# EAGLE design MaTouch ESP32-S3 AMOLED AI CAMERA v1.1 (EAGLE 6.1)
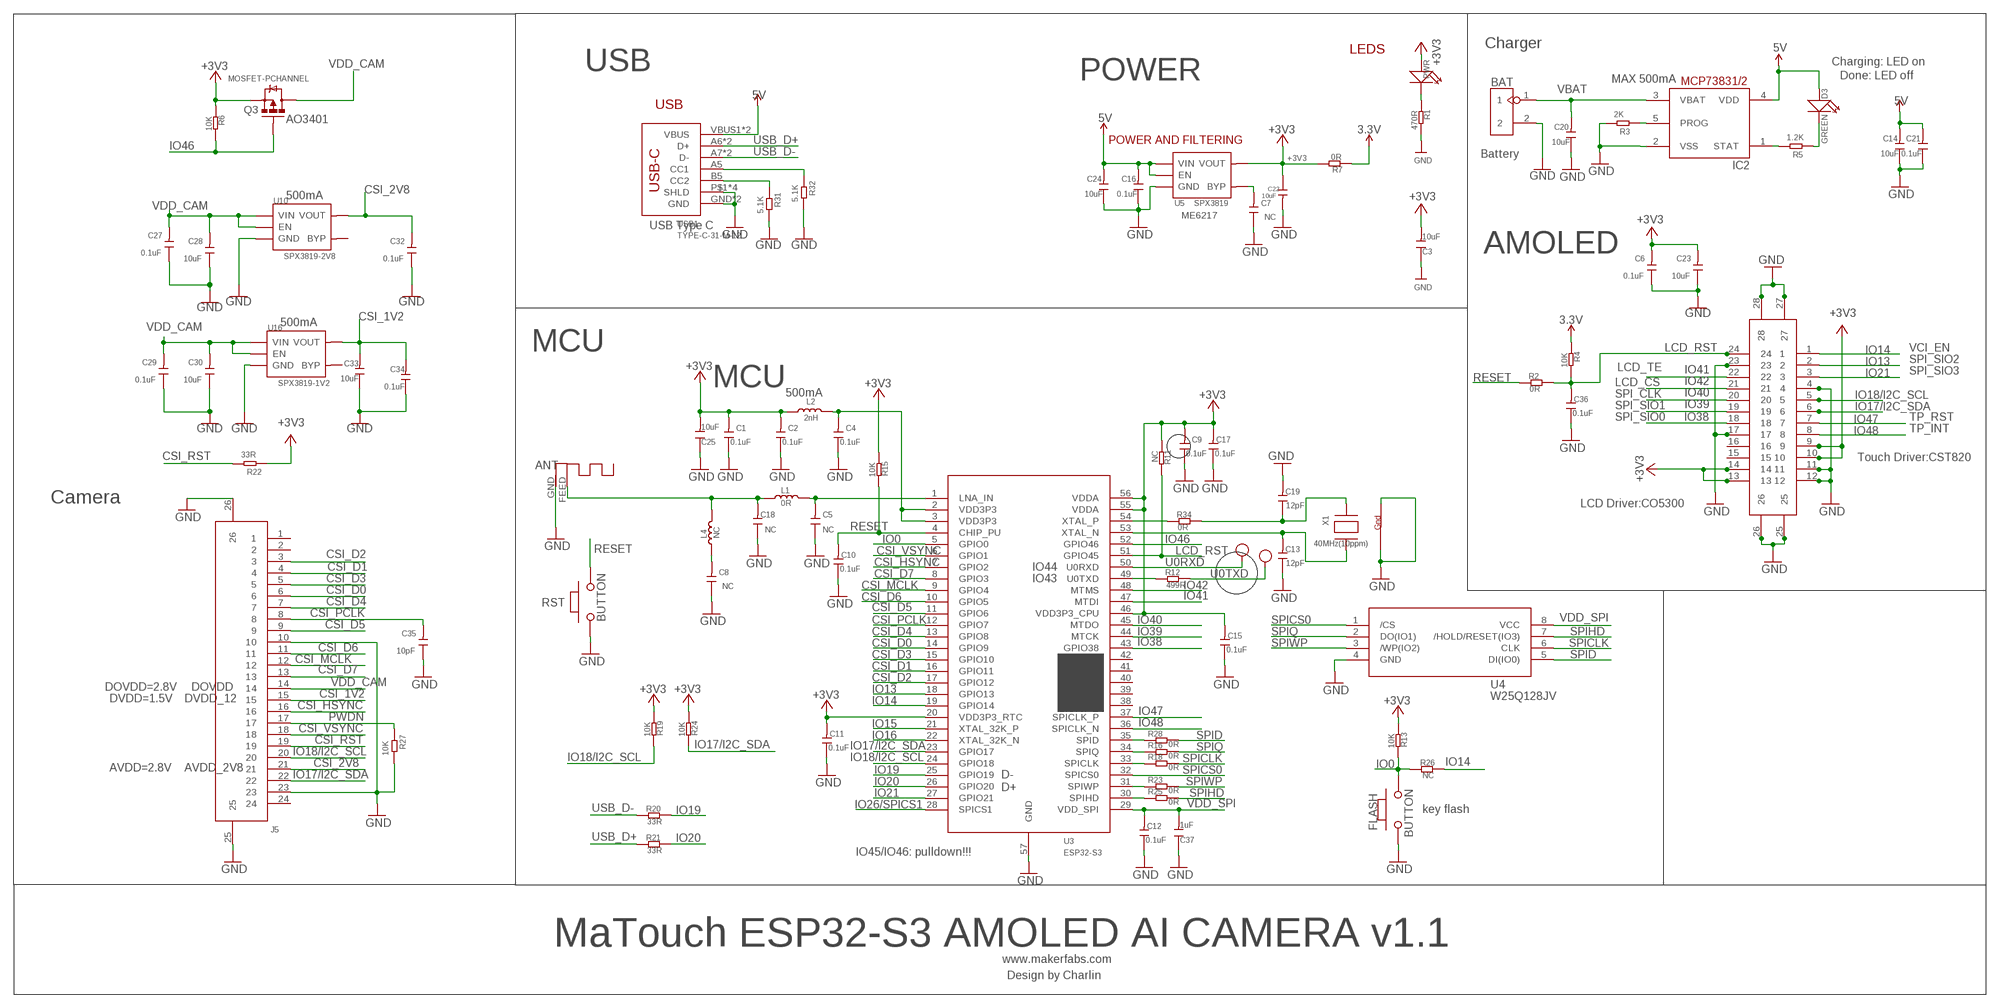
[diagram p0: schematic, sheet 1]

## Parts
ANT1  ANTENNA  [RN-ANT]
BAT  HEADER-2P-2.0  [2P-2.0]
C1  0.1uF  DISCRETE_C-0402  [DISCRETE_C0402]
C2  0.1uF  DISCRETE_C-0402  [DISCRETE_C0402]
C3  10uF  DISCRETE_C-0603  [DISCRETE_C0603]
C4  0.1uF  DISCRETE_C-0402  [DISCRETE_C0402]
C5  NC  DISCRETE_C-0402  [DISCRETE_C0402]
C6  0.1uF  DISCRETE_C-0402  [DISCRETE_C0402]
C7  NC  DISCRETE_C-0402  [DISCRETE_C0402]
C8  NC  DISCRETE_C-0402  [DISCRETE_C0402]
C9  0.1uF  DISCRETE_C-0402  [DISCRETE_C0402]
C10  0.1uF  DISCRETE_C-0402  [DISCRETE_C0402]
C11  0.1uF  DISCRETE_C-0402  [DISCRETE_C0402]
C12  0.1uF  DISCRETE_C-0402  [DISCRETE_C0402]
C13  12pF  DISCRETE_C-0402  [DISCRETE_C0402]
C14  10uF  DISCRETE_C-0402  [DISCRETE_C0402]
C15  0.1uF  DISCRETE_C-0402  [DISCRETE_C0402]
C16  0.1uF  DISCRETE_C-0402  [DISCRETE_C0402]
C17  0.1uF  DISCRETE_C-0402  [DISCRETE_C0402]
C18  NC  DISCRETE_C-0402  [DISCRETE_C0402]
C19  12pF  DISCRETE_C-0402  [DISCRETE_C0402]
C20  10uF  DISCRETE_C-0402  [DISCRETE_C0402]
C21  0.1uF  DISCRETE_C-0402  [DISCRETE_C0402]
C22  10uF  C-0603  [0603]
C23  10uF  DISCRETE_C-0402  [DISCRETE_C0402]
C24  10uF  DISCRETE_C-0402  [DISCRETE_C0402]
C25  10uF  DISCRETE_C-0603  [DISCRETE_C0603]
C27  0.1uF  DISCRETE_C-0402  [DISCRETE_C0402]
C28  10uF  DISCRETE_C-0402  [DISCRETE_C0402]
C29  0.1uF  DISCRETE_C-0402  [DISCRETE_C0402]
C30  10uF  DISCRETE_C-0402  [DISCRETE_C0402]
C32  0.1uF  DISCRETE_C-0402  [DISCRETE_C0402]
C33  10uF  DISCRETE_C-0402  [DISCRETE_C0402]
C34  0.1uF  DISCRETE_C-0402  [DISCRETE_C0402]
C35  10pF  DISCRETE_C-0402  [DISCRETE_C0402]
C36  0.1uF  DISCRETE_C-0402  [DISCRETE_C0402]
C37  1uF  DISCRETE_C-0603  [DISCRETE_C0603]
D3  GREEN  DISCRETE_LED0603  [DISCRETE_LED-0603]
FLASH  BUTTON  PB157  [157SW]
IC2  TP4054  MCP73831/OT  [SOT23-5L]
J1  OK-14GF024-04/AXE524127  AXE524127  [SMD24-50P-730L250W77H]
J5  FPC-24P  [SMD26-50P-1760L450W]
L1  0R  DISCRETE_L0402  [DISCRETE_L0402]
L2  2nH  DISCRETE_L0603  [DISCRETE_L0603]
L4  NC  DISCRETE_L0402  [DISCRETE_L0402]
PWR  DISCRETE_LED0603  [DISCRETE_LED-0603]
Q3  MOSFET-PCHANNEL  [SOT23-3]
R1  470R  DISCRETE_R-0402  [DISCRETE_R0402]
R2  0R  DISCRETE_R-0402  [DISCRETE_R0402]
R3  2K  DISCRETE_R-0402  [DISCRETE_R0402]
R4  10K  DISCRETE_R-0402  [DISCRETE_R0402]
R5  1.2K  DISCRETE_R-0402  [DISCRETE_R0402]
R6  10K  DISCRETE_R-0402  [DISCRETE_R0402]
R7  0R  DISCRETE_R-0402  [DISCRETE_R0402]
R11  NC  DISCRETE_R-0402  [DISCRETE_R0402]
R12  499R  DISCRETE_R-0402  [DISCRETE_R0402]
R13  10K  DISCRETE_R-0402  [DISCRETE_R0402]
R15  10K  DISCRETE_R-0402  [DISCRETE_R0402]
R16  0R  DISCRETE_R-0402  [DISCRETE_R0402]
R18  0R  DISCRETE_R-0402  [DISCRETE_R0402]
R19  10K  DISCRETE_R-0402  [DISCRETE_R0402]
R20  33R  DISCRETE_R-0402  [DISCRETE_R0402]
R21  33R  DISCRETE_R-0402  [DISCRETE_R0402]
R22  33R  DISCRETE_R-0402  [DISCRETE_R0402]
R23  0R  DISCRETE_R-0402  [DISCRETE_R0402]
R24  10K  DISCRETE_R-0402  [DISCRETE_R0402]
R25  0R  DISCRETE_R-0402  [DISCRETE_R0402]
R26  NC  DISCRETE_R-0402  [DISCRETE_R0402]
R27  10K  DISCRETE_R-0402  [DISCRETE_R0402]
R28  0R  DISCRETE_R-0402  [DISCRETE_R0402]
R31  5.1K  DISCRETE_R-0402  [DISCRETE_R0402]
R32  5.1K  DISCRETE_R-0402  [DISCRETE_R0402]
R34  0R  DISCRETE_R-0402  [DISCRETE_R0402]
RST  BUTTON  PB157  [157SW]
RX  TEST-POINT'4545'  [TP-D45MIL]
TX  TEST-POINT'4545'  [TP-D45MIL]
U3  ESP32-S3  [QFN56-7*7MM]
U4  W25Q128JV  [SOIC-8-208MIL]
U5  SPX3819  [SOT23-5]
U10  SPX3819-2V8  SPX3819  [SOT23-5]
U16  SPX3819-1V2  SPX3819  [SOT23-5]
USB1  TYPE-C-31-M-12  [TYPE-C-31-M-12]
X1  40MHz(10ppm)  XTAL-4-3225  [NX3225]

## Nets
3.3V: R4.2 R7.2
5V: C14.2 C16.2 C21.2 C24.2 D3.+ IC2.4(VDD) U5.1(VIN) U5.3(EN) USB1.VBUS1(VBUS) USB1.VBUS2(VBUS)
+3V3: C1.2 C2.2 C3.2 C6.2 C9.2 C11.2 C15.2 C17.2 C22.1 C23.2 C25.2 J1.9 J1.10 J1.13 J1.14 L2.1 PWR.+ Q3.2(S) R6.2 R7.1 R11.2 R13.2 R15.2 R19.2 R22.1 R24.2 U3.20(VDD3P3_RTC) U3.46(VDD3P3_CPU) U3.55(VDDA) U3.56(VDDA) U5.5(VOUT)
CSI_1V2: C33.2 C34.2 J5.15 U16.5(VOUT)
CSI_2V8: C32.2 J5.21 U10.5(VOUT)
CSI_D0: J5.6 U3.14(GPIO9)
CSI_D1: J5.4 U3.16(GPIO11)
CSI_D2: J5.3 U3.17(GPIO12)
CSI_D3: J5.5 U3.15(GPIO10)
CSI_D4: J5.7 U3.13(GPIO8)
CSI_D5: J5.9 U3.11(GPIO6)
CSI_D6: J5.11 U3.10(GPIO5)
CSI_D7: J5.13 U3.8(GPIO3)
CSI_HSYNC: J5.16 U3.7(GPIO2)
CSI_MCLK: J5.12 U3.9(GPIO4)
CSI_PCLK: C35.2 J5.8 U3.12(GPIO7)
CSI_RST: J5.19 R22.2
CSI_VSYNC: J5.18 U3.6(GPIO1)
GND: ANT1.GND BAT.2 C1.1 C2.1 C3.1 C4.1 C5.1 C6.1 C7.1 C8.1 C9.1 C10.1 C11.1 C12.1 C13.1 C14.1 C15.1 C16.1 C17.1 C18.1 C19.2 C20.1 C21.1 C22.2 C23.1 C24.1 C25.1 C27.1 C28.1 C29.1 C30.1 C32.1 C33.1 C34.1 C35.1 C36.1 C37.1 FLASH.1 IC2.2(VSS) J1.4 J1.11 J1.12 J1.17 J1.23 J1.25 J1.26 J1.27 J1.28 J5.10 J5.23 J5.25 J5.26 R1.1 R3.2 R27.2 R31.2 R32.2 RST.1 U3.57(GND) U4.4(GND) U5.2(GND) U10.2(GND) U16.2(GND) USB1.GND USB1.GND2(GND) USB1.P$1(SHLD) USB1.P$2(SHLD) USB1.P$3(SHLD) USB1.P$4(SHLD) X1.2(G2) X1.4(G1)
IO0: FLASH.2 R13.1 R26.2 U3.5(GPIO0)
IO13: J1.2 U3.18(GPIO13)
IO14: J1.1 R26.1 U3.19(GPIO14)
IO15: U3.21(XTAL_32K_P)
IO16: U3.22(XTAL_32K_N)
IO17/I2C_SDA: J1.6 J5.22 R24.1 U3.23(GPIO17)
IO18/I2C_SCL: J1.5 J5.20 R19.1 U3.24(GPIO18)
IO19: R20.1 U3.25(GPIO19)
IO20: R21.1 U3.26(GPIO20)
IO21: J1.3 U3.27(GPIO21)
IO26/SPICS1: U3.28(SPICS1)
IO38: J1.18 U3.43(GPIO38)
IO39: J1.19 U3.44(MTCK)
IO40: J1.20 U3.45(MTDO)
IO41: J1.22 U3.47(MTDI)
IO42: J1.21 U3.48(MTMS)
IO46: Q3.1(G) R6.1 U3.52(GPIO46)
IO47: J1.7 U3.37(SPICLK_P)
IO48: J1.8 U3.36(SPICLK_N)
LCD_RST: C36.2 J1.24 R2.1 R4.1 R11.1 U3.51(GPIO45)
N$1: ANT1.FEED C18.2 L1.1 L4.2
N$2: C5.2 L1.2 U3.1(LNA_IN)
N$3: R28.2 U3.35(SPID)
N$4: C8.2 L4.1
N$5: R32.1 USB1.A5(CC1)
N$7: PWR.- R1.2
N$23: IC2.5(PROG) R3.1
N$30: IC2.1(STAT) R5.2
N$32: D3.- R5.1
N$33: C4.2 L2.2 U3.2(VDD3P3) U3.3(VDD3P3)
N$34: R31.1 USB1.B5(CC2)
N$35: R16.2 U3.34(SPIQ)
N$37: R34.2 U3.54(XTAL_P)
N$38: R18.2 U3.33(SPICLK)
N$40: R23.2 U3.31(SPIWP)
N$41: R25.2 U3.30(SPIHD)
N$63: R12.2 U3.49(U0TXD)
N$65: C13.2 U3.53(XTAL_N) X1.3(X2)
N$66: C19.1 R34.1 X1.1(X1)
N$76: C7.2 U5.4(BYP)
PWDN: J5.17 R27.1
RESET: C10.2 R2.2 R15.1 RST.2 U3.4(CHIP_PU)
SPICLK: R18.1 U4.6(CLK)
SPICS0: U3.32(SPICS0) U4.1(/CS)
SPID: R28.1 U4.5(DI(IO0))
SPIHD: R25.1 U4.7(/HOLD/RESET(IO3))
SPIQ: R16.1 U4.2(DO(IO1))
SPIWP: R23.1 U4.3(/WP(IO2))
U0RXD: RX.T U3.50(U0RXD)
U0TXD: R12.1 TX.T
USB_D+: R21.2 USB1.A6(D+) USB1.B6(D+)
USB_D-: R20.2 USB1.A7(D-) USB1.B7(D-)
VBAT: BAT.1 C20.2 IC2.3(VBAT)
VDD_CAM: C27.2 C28.2 C29.2 C30.2 J5.14 Q3.3(D) U10.1(VIN) U10.3(EN) U16.1(VIN) U16.3(EN)
VDD_SPI: C12.2 C37.2 U3.29(VDD_SPI) U4.8(VCC)
Unconnected: J1.15 J1.16 J5.1 J5.2 J5.24 U3.38(GPIO33) U3.39(GPIO34) U3.40(GPIO35) U3.41(GPIO36) U3.42(GPIO37) U10.4(BYP) U16.4(BYP)

## Notes on the sheet
- Charger
- LEDS
- Charging: LED on
- USB
- POWER | Done: LED off
- MAX 500mA
- USB
- AO3401
- POWER AND FILTERING
- Battery
- 500mA
- ME6217
- USB Type C
- AMOLED
- 500mA
- MCU | VCI_EN
- SPI_SIO2
- LCD_TE
- SPI_SIO3
- MCU | LCD_CS
- 500mA | SPI_CLK
- SPI_SIO1
- SPI_SIO0 | TP_RST
- TP_INT
- Touch Driver:CST820
- ANT
- Camera
- LCD Driver:CO5300
- IO44
- IO43
- DOVDD=2.8V | DOVDD
- DVDD=1.5V | DVDD_12
- AVDD=2.8V | AVDD_2V8
- D-
- D+
- key flash
- IO45/IO46: pulldown!!!
- MaTouch ESP32-S3 AMOLED AI CAMERA v1.1
- www.makerfabs.com
- Design by Charlin

## Library data of the parts
ANT1 = adafruit:ANTENNA
BAT = Connector:HEADER-2P
C1-C21 C23-C25 C27-C30 C32-C37 = A9G:DISCRETE_C*: Ceramic Capacitors
C22 = Discrete:C*: Ceramic Capacitors
D3 PWR = A9G:DISCRETE_LED*
FLASH RST = MySMD:PB157
IC2 = adafruit:MCP73831: MCP73831/2 Miniature Single-Cell, Fully Integrated Li-Ion, Li-Polymer Charge Management Controllers. Nice and small simple lipoly charge controller, with adjustable current and status output (LED) http://www.ladyada.net/library/pcb/eaglelibrary.html
J1 = user:AXE524127
J5 = self:FPC-24P
L1 L2 L4 = A9G:DISCRETE_L*
Q3 = User-Submitted:MOSFET-PCHANNEL: Generic PMOSFET IRLML2244 - TRANS-11153 (SOT-23 -20V -4.3A) (1.Gate 2.Source 3.Drain) FQP27P06 - COM-10349 <http://www.sparkfun.com/products/10349> (TO-220 -60V -27A) (1.Gate 2.Source 3.Drain); PROD_ID: TRANS-08285
R1-R7 R11-R13 R15 R16 R18-R28 R31 R32 R34 = A9G:DISCRETE_R*
RX TX = Discrete-new:TEST-POINT; PARTNO: DNP
U3 = sale:ESP32-S3
U4 = self:W25Q128JV
U5 U10 U16 = IC:SPX3819
USB1 = sale:TYPE-C-31-M-12
X1 = adafruit:XTAL-4: Classic 4-pin 3.2 x 2.5mm crystal

## Net classes
0 default: width 0.203 mm
1 vbat: width 0.254 mm, drill 0.305 mm, clearance 0.203 mm

## Board
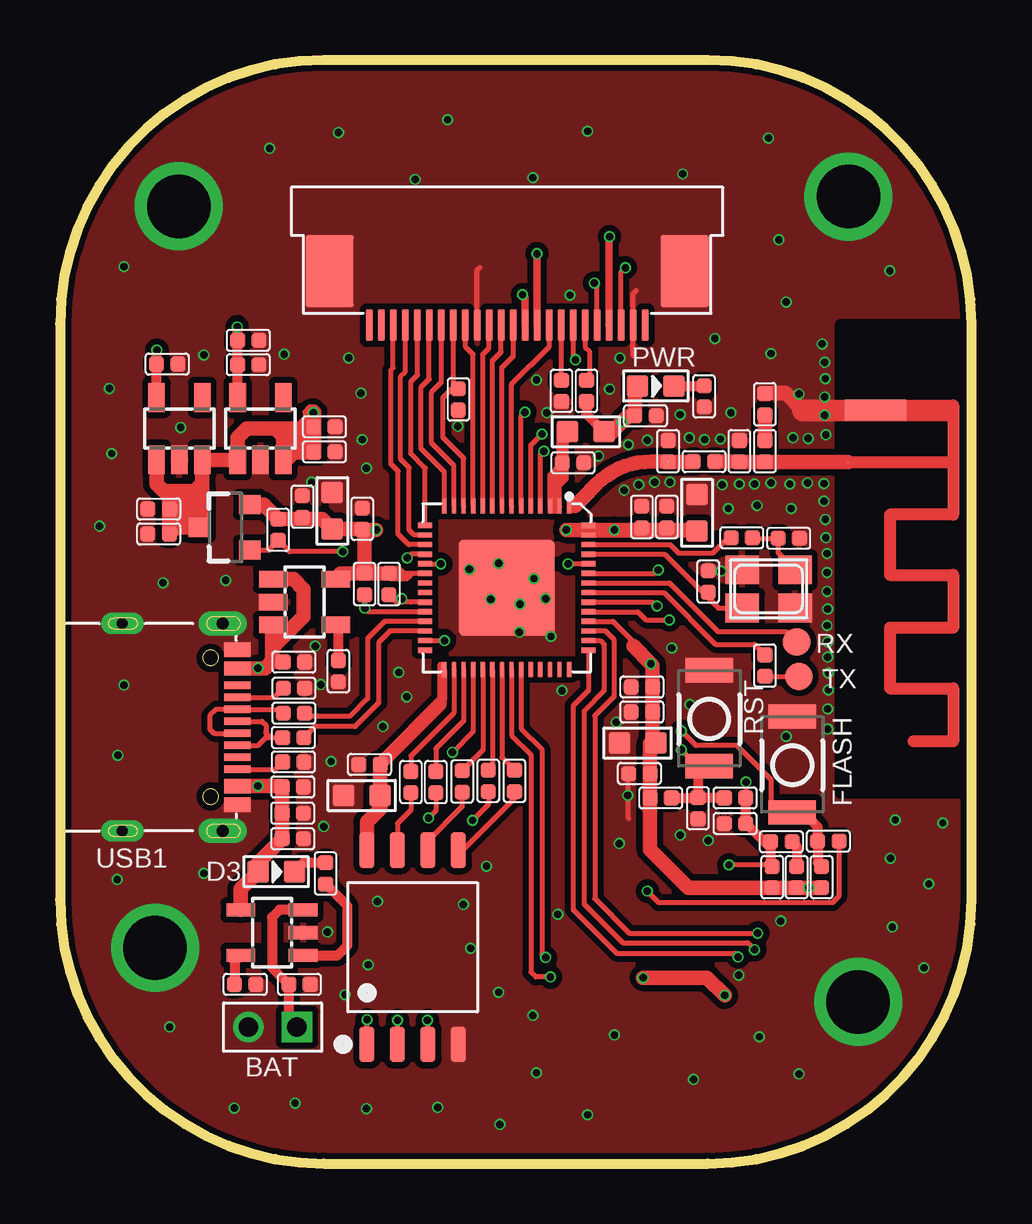
[diagram p1: board, top side]
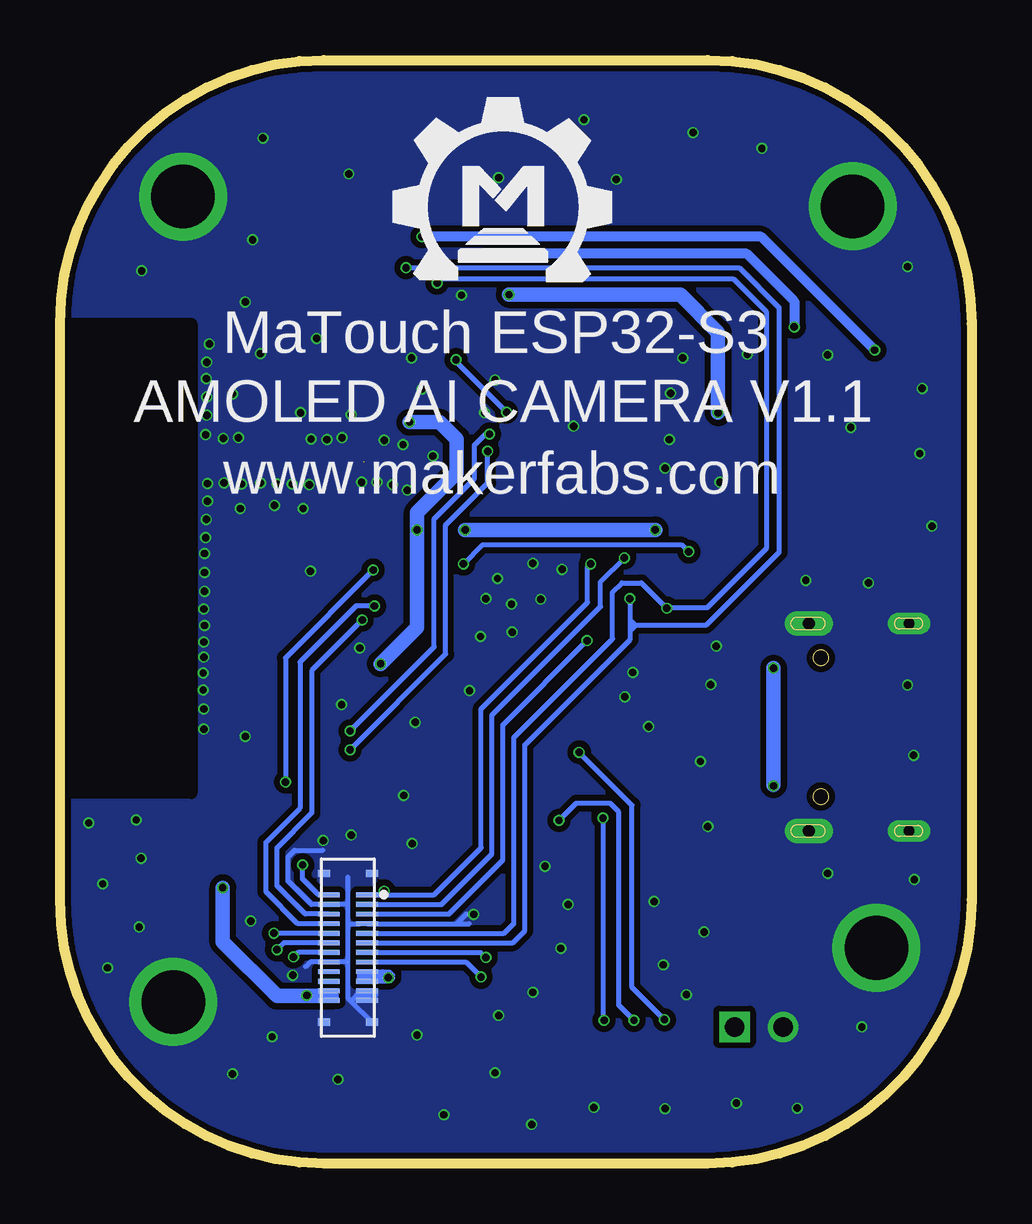
[diagram p2: board, bottom side, seen from below]

Size 38 x 46 mm. Coordinates in mm from the lower left corner, seen from the top.
Outline: 38,11 38,35 arc90 27,46 11,46 arc90 0,35 0,11 arc90 11,0 27,0 arc90 38,11
Copper layers (1*16): Top 0.035mm / dielectric 1.5mm / Bottom 0.035mm
Design rules: minimum track width 6mil, minimum drill 10mil, track to track 6mil, track to pad 6mil, pad to pad 6mil, via to via 6mil, smd to smd 0mil, copper to edge 10mil, drill to drill 10mil, minimum pad ring 3mil, minimum via ring 3mil, stop-mask expansion 2mil, vias tented up to drill 100mil, thermal gap 0mil
tRestrict: area 32.5,15.5 to 40.1,35
bRestrict: area 32.5,15.4 to 40.1,35

### Footprints (pad centres in the part's own frame; a part is rotated, then mirrored left to right if it is on the bottom)
RN-ANT = smd 0.025 x 0.025: FEED 0,2.159 | smd 2.54 x 0.889: GND -1.143,0
2P-2.0 = drill 0.813 pad 1.27 square: 1 -1.016,0 | drill 0.813 pad 1.27: 2 1.016,0
DISCRETE_C0402 = smd 0.635 x 0.635: 1 -0.445,0; 2 0.445,0
DISCRETE_C0603 = smd 0.889 x 0.889: 1 -0.762,0; 2 0.762,0
0603 = smd 0.889 x 0.889: 1 -0.762,0; 2 0.762,0
DISCRETE_LED-0603 = smd 0.889 x 0.889: + -0.762,0; - 0.762,0
157SW = smd 1.016 x 1.981: 1 0,0; 2 4,0
SOT23-5L = smd 0.55 x 1.2: 1 -0.95,-1.3; 2 0,-1.3; 3 0.95,-1.3; 4 0.95,1.3; 5 -0.95,1.3
SMD24-50P-730L250W77H = smd 0.2 x 0.9: 1 -2.2,0.8; 2 -1.8,0.8; 3 -1.4,0.8; 4 -1,0.8; 5 -0.6,0.8; 6 -0.2,0.8; 7 0.2,0.8; 8 0.6,0.8; 9 1,0.8; 10 1.4,0.8; 11 1.8,0.8; 12 2.2,0.8; 13 2.2,-0.8; 14 1.8,-0.8; 15 1.4,-0.8; 16 1,-0.8; 17 0.6,-0.8; 18 0.2,-0.8; 19 -0.2,-0.8; 20 -0.6,-0.8; 21 -1,-0.8; 22 -1.4,-0.8; 23 -1.8,-0.8; 24 -2.2,-0.8 | smd 0.3 x 0.5: 25 -3.1,-1; 26 -3.1,1; 27 3.1,1; 28 3.1,-1
SMD26-50P-1760L450W = smd 0.3 x 1.3: 1 5.75,0; 2 5.25,0; 3 4.75,0; 4 4.25,0; 5 3.75,0; 6 3.25,0; 7 2.75,0; 8 2.25,0; 9 1.75,0; 10 1.25,0; 11 0.75,0; 12 0.25,0; 13 -0.25,0; 14 -0.75,0; 15 -1.25,0; 16 -1.75,0; 17 -2.25,0; 18 -2.75,0; 19 -3.25,0; 20 -3.75,0; 21 -4.25,0; 22 -4.75,0; 23 -5.25,0; 24 -5.75,0 | smd 2 x 3: 25 -7.4,-2.25; 26 7.4,-2.25
DISCRETE_L0402 = smd 0.635 x 0.635: 1 -0.445,0; 2 0.445,0
DISCRETE_L0603 = smd 0.889 x 0.889: 1 -0.762,0; 2 0.762,0
SOT23-3 = smd 0.8 x 0.9: 1 -0.95,-1; 2 0.95,-1; 3 0,1.1
DISCRETE_R0402 = smd 0.635 x 0.635: 1 -0.445,0; 2 0.445,0
TP-D45MIL = smd 1.143 x 1.143: T 0,0
QFN56-7*7MM = smd 0.6 x 0.2: 1 -3.4,2.6; 2 -3.4,2.2; 3 -3.4,1.8; 4 -3.4,1.4; 5 -3.4,1; 6 -3.4,0.6; 7 -3.4,0.2; 8 -3.4,-0.2; 9 -3.4,-0.6; 10 -3.4,-1; 11 -3.4,-1.4; 12 -3.4,-1.8; 13 -3.4,-2.2; 14 -3.4,-2.6; 29 3.4,-2.6; 30 3.4,-2.2; 31 3.4,-1.8; 32 3.4,-1.4; 33 3.4,-1; 34 3.4,-0.6; 35 3.4,-0.2; 36 3.4,0.2; 37 3.4,0.6; 38 3.4,1; 39 3.4,1.4; 40 3.4,1.8; 41 3.4,2.2; 42 3.4,2.6 | smd 0.2 x 0.6: 15 -2.6,-3.4; 16 -2.2,-3.4; 17 -1.8,-3.4; 18 -1.4,-3.4; 19 -1,-3.4; 20 -0.6,-3.4; 21 -0.2,-3.4; 22 0.2,-3.4; 23 0.6,-3.4; 24 1,-3.4; 25 1.4,-3.4; 26 1.8,-3.4; 27 2.2,-3.4; 28 2.6,-3.4; 43 2.6,3.4; 44 2.2,3.4; 45 1.8,3.4; 46 1.4,3.4; 47 1,3.4; 48 0.6,3.4; 49 0.2,3.4; 50 -0.2,3.4; 51 -0.6,3.4; 52 -1,3.4; 53 -1.4,3.4; 54 -1.8,3.4; 55 -2.2,3.4; 56 -2.6,3.4 | smd 4 x 4: 57 0,0
SOIC-8-208MIL = smd 1.5 x 0.635: 1 -4.05,1.905; 2 -4.05,0.635; 3 -4.05,-0.635; 4 -4.05,-1.905; 5 4.05,-1.905; 6 4.05,-0.635; 7 4.05,0.635; 8 4.05,1.905
SOT23-5 = smd 0.69 x 1.2: 1 -0.95,-1.3; 2 0,-1.3; 3 0.95,-1.3; 4 0.95,1.3; 5 -0.95,1.3
TYPE-C-31-M-12 = smd 0.3 x 1.1: A5 -1.25,0.05; A6 -0.25,0.05; A7 0.25,0.05; A8 1.25,0.05; B5 1.75,0.05; B6 0.75,0.05; B7 -0.75,0.05; B8 -1.75,0.05 | smd 0.6 x 1.1: GND -3.225,0.05; GND2 3.225,0.05; VBUS1 -2.45,0.05; VBUS2 2.45,0.05 | drill 0.5 pad 1.016 long: P$1 4.32,-0.57; P$2 -4.32,-0.57 | drill 0.45 pad 0.9 long: P$3 -4.32,-4.75; P$4 4.32,-4.75
NX3225 = smd 1.4 x 1.2: 1 -1.1,-0.8; 2 1.1,-0.8; 3 1.1,0.8; 4 -1.1,0.8

### Placement (x,y rotation side)
ANT1  32.84,31.39 180 top
BAT  8.86,5.69 180 top
C1  24.26,18.82 0 top
C2  12.6,26.87 270 top
C3  11.35,27.2 270 top
C4  21.39,29.21 180 top
C5  25.35,29.69 270 top
C6  24.41,31.17 180 top
C7  11.61,20.52 90 top
C8  29.39,31.65 270 top
C9  24.26,26.95 270 top
C10  26.59,14.81 90 top
C11  10.11,27.38 270 top
C12  12.9,16.64 0 top
C13  27.03,24.26 270 top
C14  9.7,14.61 180 top
C15  24.16,16.26 0 top
C16  9.75,20.9 180 top
C17  25.3,26.95 270 top
C18  28.32,29.69 270 top
C19  30.38,26.06 0 top
C20  9.98,7.47 180 top
C21  9.7,13.54 180 top
C22  26.56,27.12 90 top
C23  24.26,19.86 0 top
C24  9.7,15.7 180 top
C25  24.08,17.53 0 top
C27  11.02,29.67 180 top
C28  4.11,26.24 0 top
C29  4.11,27.28 0 top
C30  11.02,30.71 180 top
C32  4.47,33.32 180 top
C33  7.85,34.32 180 top
C34  7.85,33.3 180 top
C35  16.61,31.85 90 top
C36  28.14,14.17 0 top
C37  12.58,15.34 0 top
D3  9.02,12.17 0 top
FLASH  30.52,18.63 270 top
IC2  8.84,9.63 90 top
J1  26,9 270 bottom
J5  18.64,34.95 180 top
L1  26.85,29.26 180 top
L2  21.92,30.51 180 top
L4  29.39,29.69 270 top
PWR  24.84,32.41 0 top
Q3  6.91,26.52 90 top
R1  26.85,31.98 90 top
R2  28.14,15.24 180 top
R3  7.72,7.47 0 top
R4  30.07,13.41 0 top
R5  11.07,12.09 270 top
R6  9.09,26.42 90 top
R7  30.71,11.94 90 top
R11  29.69,11.94 270 top
R12  29.39,20.75 90 top
R13  31.75,11.94 270 top
R15  25.04,15.24 180 top
R16  17.86,15.95 90 top
R18  16.76,15.93 90 top
R19  12.7,24.16 90 top
R20  9.75,18.77 180 top
R21  9.73,17.75 180 top
R22  21.95,32.21 90 top
R23  15.67,15.9 90 top
R24  13.72,24.16 90 top
R25  14.63,15.9 90 top
R26  32.03,13.44 180 top
R27  20.9,32.21 270 top
R28  18.95,15.95 90 top
R31  9.73,16.74 0 top
R32  9.75,19.81 0 top
R34  28.42,26.09 180 top
RST  27.06,20.56 270 top
RX  30.71,21.74 90 top
TX  30.81,20.29 90 top
U3  18.63,24 270 top
U4  14.7,9.02 90 top
U5  10.2,23.41 270 top
U10  4.98,30.63 0 top
U16  8.36,30.63 0 top
U$1  [MAKERFABS_0.3]  23.65,36.81 0 bottom
USB1  7.35,18.19 270 top
X1  29.54,23.95 180 top

### Tracks (layer width: path | path; a pad name or v marks a point on that pad's centre or on a via)
3.3V
  Top 0.406: R4.2 30.71,13.22 R7.2
5V  (via drill 0.3)
  Top 0.203: v8.26,20.65 8.26,20.64
  Top 0.61: 8.85,20.94 8.85,21.49 | C16.2 8.89,20.9 8.85,20.94 | U5.1 9.73,24.36 10.16,23.93 10.16,22.8 8.85,21.49 | IC2.4 7.54,11.45 D3.+ 8.26,12.54 C21.2 C14.2 C24.2 9.22,15.74 v8.26,15.74 USB1.VBUS2 | USB1.VBUS1 8.26,20.64 8.55,20.64 8.85,20.94 | 8.85,21.49 8.85,22.41 U5.3
  Bottom 0.203: 8.26,15.79 v8.26,15.74
  Bottom 0.61: v8.26,20.65 8.26,15.79
+3V3  (via drill 0.3)
  Top 0.203: R24.2 | U3.46 23.04,22.6 24.32,21.32 | L2.1 22.64,30.38 | C22.1 26.39,26.2 U3.55 U3.56 24.16,26.6 | 24.16,26.6 C9.2 C17.2 | U3.20 R24.2 | 24.16,26.6 23.98,26.42 v23.11,26.42 | 24.62,21.02 24.32,21.32 | 23.9,21.57 24.14,21.32 24.32,21.32 | 14.61,24.51 14.48,24.38 13.77,24.38 14.02,24.64 14.02,24.69 14.1,24.61 14.33,24.61 14.12,24.82 13.64,24.82 13.61,24.79 12.24,24.79 12.55,25.09 12.8,25.09 13.3,24.6 R24.2 | 14.68,24.59 14.61,24.51 | 14.61,24.51 13.87,24.51
  Top 0.406: R22.1 21.95,31.24 L2.1
  Top 0.61: 22.64,30.38 22.9,30.38 v23.43,30.91 23.69,31.17 C6.2 23.96,32.3 PWR.+ | 23.9,21.57 v24.64,20.83 24.7,20.77 C23.2 C1.2 24.7,17.61 C25.2 24.6,17.51 C15.2 R15.2 24.6,13.09 26.2,11.49 R11.2 | v21.11,26.42 v23.11,26.42 26.54,26.42 | v13.18,26.42 12.61,26.42 C2.2 | Q3.2 8.49,27.47 R6.2 10.03,26.86 | 10.03,26.86 10.94,26.86 C3.2 12.59,26.44 C2.2 | C11.2 10.03,26.86 | R24.2 R19.2 | R19.2 11.7,24.6 U5.5 | R19.2 12.7,26.33 C2.2 | R13.2 v31.22,11.49 | v31.22,11.49 R7.1 R11.2 | v31.22,11.49 R11.2 | v27.71,7.01 26.98,7.75 v24.31,7.75
  Bottom 0.203: J1.9 J1.10 | J1.14 J1.13 | J1.9 25.02,8 | 25.02,8 24.84,8 | 24.84,8 24.56,8 v24.31,7.75 | v27.71,7.01 27.5,6.8 J1.13 | 26.67,6.99 26.8,6.86 J1.13 | 25.53,7.6 25.53,8 25.35,8 | 25.35,8 25.35,7.6 | 25.02,8 25.02,7.6 | 24.84,8 24.84,7.6 | 25.25,7.75 25.12,7.62 24.23,7.62 24.13,7.72 24.13,7.85 24.26,7.98 25.2,7.98 | 25.2,7.98 25.04,7.82 24.49,7.82 | 25.35,8 J1.9 | 25.2,7.98 J1.9
  Bottom 0.61: v23.43,30.91 22.17,30.91 21.46,30.2 21.46,28.78 23.11,27.13 v23.11,26.42 23.11,22.35 v24.64,20.83 | v21.11,26.42 v13.18,26.42 | v31.22,11.49 31.22,9.25 28.96,6.99 26.67,6.99
CSI_1V2  (via drill 0.3)
  Top 0.254: v19.89,37.92
  Top 0.305: J5.15 v19.89,37.92
  Top 0.406: U16.5 C34.2 C33.2 7.4,34.86 v7.39,34.87
  Bottom 0.406: v7.39,34.87 7.39,35.94 9.37,37.92 v19.89,37.92
CSI_2V8  (via drill 0.3)
  Top 0.254: 22.89,38.62 v22.91,38.63
  Top 0.305: J5.21 22.89,38.62
  Top 0.406: U10.5 C32.2 4.03,33.9 v4.04,33.91
  Bottom 0.406: v4.04,33.91 8.76,38.63 v22.91,38.63
CSI_D0
  Top 0.203: U3.14 16.03,28.83 15.06,29.79 15.06,32.36 15.39,32.69 J5.6
CSI_D1
  Top 0.203: U3.16 14.77,26.2 14.55,26.42 14.55,29.01 14.2,29.36 14.2,32.82 14.4,33.02 14.4,34.94 J5.4
CSI_D2
  Top 0.203: U3.17 14.54,25.8 14.1,26.24 14.1,28.85 13.79,29.16 13.79,33.07 13.89,33.17 J5.3 | J5.3
CSI_D3
  Top 0.203: U3.15 15.23,29 14.63,29.59 14.63,32.59 14.91,32.87 14.91,34.93 J5.5
CSI_D4
  Top 0.203: U3.13 16.43,29.09 15.49,30.02 15.49,32.16 15.9,32.56 J5.7
CSI_D5
  Top 0.203: U3.11 17.23,33.73 16.89,34.06 J5.9
CSI_D6
  Top 0.203: U3.10 17.63,33.73 17.88,33.98 17.88,34.93 J5.11
CSI_D7
  Top 0.203: U3.8 18.43,33.18 18.9,33.66 J5.13
CSI_HSYNC
  Top 0.203: U3.7 18.83,32.49 20.4,34.06 J5.16
CSI_MCLK
  Top 0.203: U3.9 18.03,33.47 18.39,33.83 J5.12
CSI_PCLK
  Top 0.203: U3.12 16.83,29.4 15.98,30.25 15.98,31.93 16.34,32.3 C35.2 16.39,32.51 J5.8
CSI_RST
  Top 0.203: J5.19 21.89,34.04 22.07,33.86 22.07,32.8 R22.2
CSI_VSYNC  (via drill 0.3)
  Top 0.203: U3.6 19.23,31.16 v19.38,31.32 | 21.39,34.94 J5.18 21.39,33.6 v21.49,33.5
  Bottom 0.203: v19.38,31.32 21.49,33.43 v21.49,33.5
GND  (via drill 0.3, 2.65)  (1 unrouted)
  Top 0.203: 29.4,32.11 C8.1 | J5.10 17.39,37.26 17.5,37.36 | 24.03,36.4 23.89,36.26 J5.23 23.89,33.67 | 23.93,16.04 C15.1 23.7,16.24 23.7,14.38
  Top 0.61: 30.96,31.39 30.25,32.11 29.4,32.11
  Top 0.889: ANT1.GND 30.96,31.39
  Bottom 0.203: 26.01,11.94 26.01,10.79 | 26.01,10.79 26.01,10 | 26.01,10 26.01,9.98 | 26.01,9.98 26.01,8.41 | 26.01,8.41 26.01,6.91 25.86,6.76 | 25.86,6.76 J1.27 | 25.99,10 26.01,9.98 | 26.02,8.4 26.01,8.41 | J1.17 27.57,8.4 27.76,8.2 | 27.05,13.06 28.22,13.06 28.5,12.78 28.5,11.79 27.51,10.8 J1.23 26.02,10.8 26.01,10.79 | J1.4 21.46,10 | 21.46,10 20.94,10 | v20.75,10.39 21.07,10.39 21.46,10 | 26.01,10 25.48,10 | 26.01,8.4 26.78,8.4 | 24.82,7.03 25.65,7.03 25.65,6.96 25.86,6.76
  other vias: 7.26,2.31 32.87,40.31 4.95,39.9 3.96,8.99 33.27,6.73 22.45,29.49 20.29,31.29 26.24,30.25 27.61,28.3 23.19,18.39 30.28,17.81 18.29,25.02 10.87,19.96 16.59,30.73 11.15,9.65 23.7,29.97 24.49,30.15 24.13,28.3 25.43,28.4 19.15,22.15 20.24,23.55 17.96,23.52 19.76,24.38 20.47,21.97 19.18,23.32 2.41,17.02 2.67,19.94 4.29,24.21 2.06,32.31 1.65,26.57 5.03,30.68 5.99,33.71 9.35,33.73 2.67,37.39 8.74,42.32 16.15,43.51 22,43.03 29.54,42.75 30.28,35.92 34.59,37.21 22.91,32.28 21.26,36.2 12.55,32.11 12.78,28.98 26.26,19.13 28.32,28.32 28.96,28.32 29.64,28.37 31.17,28.37 31.85,28.35 31.85,27.61 31.9,26.85 31.93,26.09 31.98,25.43 31.98,24.64 31.98,23.85 32,23.11 31.98,22.43 32,21.74 32,21.11 32.03,20.45 32.03,19.74 32,18.95 32,18.11 30.43,28.32 29.06,27.43 27.86,27.3 23.52,28.07 24.79,28.4 27.53,30.2 26.87,30.18 27.97,31.29 25.86,31.22 27.3,34.39 31.78,34.16 31.88,33.4 31.9,32.72 31.88,31.95 31.88,31.19 31.93,30.38 31.19,30.23 30.56,30.25 29.64,33.76 30.81,32.08 25.5,21.49 27.56,24.69 30.48,27.3 34.82,14.33 36.8,14.2 36.22,11.66 34.62,12.73 34.7,9.86 36.02,8.15 30.81,3.73 26.42,3.51 23.11,5.36 22,2.03 18.34,1.63 12.78,2.29 9.8,2.51 16.81,10.79 11.3,16.76 11,14.05 14.12,20.47 5.99,12.09 2.39,11.84 4.57,5.69 11.89,7.04 17.12,8.97 6.91,24.31 17.07,24.77 12.04,33.58 12.6,30.18 10.49,28.4 2.16,29.59 27.03,13.46 12.85,8.28 13.23,10.92 13.46,18.21 14.45,19.46 11.61,42.98 14.81,41.02 19.71,41.1 25.96,41.25 29.97,38.51 23.67,15.34 19.86,3.78 29.16,5.28 19.86,32.66 23.34,33.58 19.71,6.17 23.32,13.34 30.05,10.11 20.93,19.71 10.64,21.56 17.78,12.4 18.29,7.14 15.75,2.34 28.3,7.85 25.86,13.69
  pour Top (isolate 0.254, rank 6): -10,85 -10,-5 85,-5 85,85
  pour Bottom (isolate 0.254, rank 6): -11,-5 85,-5 85,85 -11,85
IO0  (via drill 0.3)
  Top 0.203: U3.5 19.63,29.94 v20.09,30.4 | FLASH.2 29.97,14.63 29.64,14.96 29.64,16 28.22,17.42 26.52,17.42 v25.91,18.03
  Top 0.406: R13.1 31.59,12.55 R26.2 31.59,14.03 30.98,14.63 FLASH.2
  Bottom 0.203: v20.09,30.4 20.27,30.4 20.73,29.95 20.73,28.55 22.4,26.87 22.4,21.54 v25.91,18.03
IO13  (via drill 0.3)
  Top 0.203: U3.18 14.63,25.4 v14.48,25.25
  Bottom 0.203: v14.48,25.25 15.47,24.26 15.47,23.22 19.99,18.69 19.99,12.9 22.09,10.8 J1.2
IO14  (via drill 0.3)
  Top 0.203: R26.1 32.46,13.42 32.46,11.12 32.21,10.87 24.97,10.87 v24.49,11.35 | U3.19 v15.87,25 v15.88,24.99
  Bottom 0.203: v15.88,24.99 16,24.87 16,23.39 20.45,18.95 20.45,13.16 22.4,11.2 J1.1 24.64,11.2 v24.49,11.35
IO17/I2C_SDA  (via drill 0.3)
  Top 0.203: 14.25,23.4 U3.23 14.62,23.4 | 14.25,23.4 14.03,23.4 R24.1 | J5.22 23.39,37.16 v23.57,37.34 | v14.25,23.55 14.25,23.4
  Bottom 0.203: J1.6 19.12,9.2 18.62,9.7 18.62,17.45 14.22,21.84 14.22,22.23 | 14.22,22.23 14.22,22.45 | 14.22,22.45 14.22,22.63 | 14.22,22.63 14.22,23.52 v14.25,23.55 | v23.57,37.34 9.68,37.34 8.03,35.69 8.03,25.48 11.07,22.43 14.02,22.43 | 14.02,22.43 14.2,22.43 14.22,22.45 | 14.22,22.63 14.02,22.43 | 14.02,22.43 14.22,22.23
IO18/I2C_SCL  (via drill 0.3)
  Top 0.203: U3.24 12.85,23 v12.71,23.15 v12.7,23.15 R19.1 | J5.20 22.39,36.58 v22.28,36.7
  Bottom 0.203: J1.5 19.48,9.6 19.07,10.01 19.07,17.75 14.96,21.87 14.96,23.82 14.58,24.21 13.77,24.21 v12.71,23.15 12.69,23.16 11.02,23.16 8.56,25.63 8.56,35.51 9.93,36.88 22.1,36.88 v22.28,36.7
IO19
  Top 0.203: U3.25 13.53,22.6 12.83,21.89 12.83,19.38 12.09,18.64 10.32,18.64 R20.1
IO20
  Top 0.203: U3.26 13.77,22.2 13.28,21.72 13.28,19.61 13.28,19.28 13.28,19.2 12.29,18.21 10.63,18.21 R21.1
IO21  (via drill 0.3)
  Top 0.203: U3.27 v16.02,21.8 v16.03,21.79
  Bottom 0.203: v16.03,21.79 19.53,18.29 19.53,12.65 21.78,10.4 J1.3
IO38  (via drill 0.3)
  Top 0.203: U3.43 22.03,19.71 21.39,19.07 21.39,10.59 23.22,8.76 28.12,8.76 v28.27,8.61
  Bottom 0.203: J1.18 28.08,8.8 v28.27,8.61
IO39  (via drill 0.3)
  Top 0.203: U3.44 22.52,21.8 22.68,21.64 22.68,19.71 21.84,18.87 21.84,10.82 23.46,9.2 28.67,9.2 v28.96,8.91
  Bottom 0.203: J1.19 28.67,9.2 v28.96,8.91
IO40  (via drill 0.3)
  Top 0.203: U3.45 22.73,22.2 23.11,21.82 23.11,19.48 22.3,18.67 22.3,11.05 23.75,9.6 v29.08,9.6
  Bottom 0.203: J1.20 v29.08,9.6
IO41  (via drill 0.3)
  Top 0.203: U3.47 24.09,23 24.43,22.66 v25.4,22.66
  Bottom 0.203: v25.4,22.66 27.51,20.55 27.51,14.61 28.96,13.16 28.96,11.58 27.77,10.4 J1.22
IO42  (via drill 0.3)
  Top 0.203: U3.48 24.73,23.4 v24.89,23.24
  Bottom 0.203: v24.89,23.24 25.65,23.24 27.99,20.9 27.99,14.81 29.41,13.39 29.41,11.33 28.09,10 J1.21
IO46  (via drill 0.3)
  Top 0.203: U3.52 v21.19,25 v21.18,24.99 | Q3.1 8.69,25.57 R6.1 9.56,25.5 v11.79,25.5
  Bottom 0.203: v11.79,25.5 12.06,25.78 20.4,25.78 v21.18,24.99
IO47  (via drill 0.3)
  Top 0.203: U3.37 19.23,18.14 20.09,17.27 20.09,8.74 v20.24,8.59
  Bottom 0.203: J1.7 20.46,8.8 v20.24,8.59
IO48  (via drill 0.3)
  Top 0.203: U3.36 18.83,17.85 19.63,17.04 19.63,7.98 19.84,7.77 v20.45,7.77
  Bottom 0.203: J1.8 21.07,8.4 v20.45,7.77
LCD_RST  (via drill 0.3)
  Top 0.203: U3.51 24.8,24.6 v24.94,24.74 | v28.6,15.9 28.59,15.89 R2.1 | 29.67,13.45 R4.1 | 29.63,12.45 v27.89,12.45
  Top 0.406: R11.1 29.63,12.45 29.63,13.13 | 29.63,13.13 R4.1 | 29.63,13.13 C36.2 R2.1
  Bottom 0.203: v28.6,15.9 28.6,21.08 v24.94,24.74 | J1.24 27.23,11.2 27.89,11.86 v27.89,12.45
N$1
  Top 0.61: L1.1 28.31,29.26 C18.2 L4.2 ANT1.FEED
N$2  (1 unrouted)
  Top 0.203: U3.1 21.46,27.4 21.78,27.72
  Top 0.61: C5.2 24.65,29.26 arc45 22.37,28.32 21.78,27.72 21.46,27.41 | C5.2 26.39,29.25 L1.2
N$3
  Top 0.203: U3.35 18.43,16.92 R28.2
N$4
  Top 0.61: L4.1 C8.2
N$5
  Top 0.203: R32.1 8.93,19.44 USB1.A5
N$7
  Top 0.406: PWR.- 26.84,32.41 R1.2
N$23
  Top 0.406: IC2.5 7.28,8.41 R3.1
N$30
  Top 0.406: IC2.1 11.57,8.68 11.99,9.09 11.99,10.73 R5.2
N$32
  Top 0.406: R5.1 10.15,12.54 D3.-
N$33
  Top 0.203: C4.2 20.43,28.69 U3.3 U3.2 | U3.2 20.83,28.27 21.11,28.55 21.11,30.4 L2.2 | 20.45,27.2 20.8,27.2 20.8,27.3 | 20.8,27.3 20.65,27.46 | 20.8,27.3 20.8,27.38 U3.2
  Top 0.406: 20.65,27.46 20.65,28.5 20.9,28.75 20.9,30.73
N$34
  Top 0.203: USB1.B5 8.98,16.44 R31.1
N$35
  Top 0.203: U3.34 18.03,16.57 R16.2
N$37
  Top 0.203: U3.54 25.43,25.8 25.78,25.45 27.23,25.45 27.86,26.09 R34.2
N$38
  Top 0.203: U3.33 17.63,17.23 R18.2
N$40
  Top 0.203: U3.31 16.83,18.45 15.67,17.3 R23.2
N$41
  Top 0.203: U3.30 16.43,18.79 14.63,16.99 R25.2
N$63
  Top 0.203: U3.49 25.17,23.8 27.33,21.64 28.94,21.64 R12.2
N$65
  Top 0.203: U3.53 25.2,25.4 26.92,23.67 | 26.92,23.67 27.45,23.15 X1.3 | C13.2 26.92,23.71 26.92,23.67
N$66
  Top 0.203: R34.1 28.89,26.06 C19.1 29.93,25.46 X1.1
N$76
  Top 0.406: C7.2 11.61,22.3 U5.4
PWDN
  Top 0.203: J5.17 20.89,32.79 R27.1
RESET  (via drill 0.3)
  Top 0.203: U3.4 20.03,29.55 v20.17,29.69 | RST.2 26.6,16.56 v25.91,17.25
  Top 0.406: R15.1 C10.2 | C10.2 27.69,15.25 R2.2 | 26.6,16.56 C10.2
  Bottom 0.203: v20.17,29.69 20.17,28.37 21.92,26.62 21.92,21.23 v25.91,17.25
SPICLK
  Top 0.203: R18.1 16.76,14.88 15.34,13.46 U4.6
SPICS0  (via drill 0.3)
  Top 0.203: U3.32 17.23,18.01 v16.36,17.14 | U4.1 v12.79,5.99 v12.8,5.99
  Bottom 0.203: v12.8,5.99 14.15,7.34 14.15,14.94 v16.36,17.14
SPID
  Top 0.203: U4.5 16.8,13.07 18.95,15.21 R28.1
SPIHD
  Top 0.203: R25.1 14.63,14.73 14.07,14.17 14.07,13.07 U4.7
SPIQ  (via drill 0.3)
  Top 0.203: U4.2 v14.06,5.96 v14.07,5.97 | R16.1 17.86,14.96 v17.2,14.3
  Bottom 0.203: v14.07,5.97 14.71,6.6 14.71,14.66 15.06,15.01 16.48,15.01 v17.2,14.3
SPIWP  (via drill 0.3)
  Top 0.203: R23.1 15.67,14.71 v15.37,14.4 | U4.3 15.34,5.95 v15.32,5.97
  Bottom 0.203: v15.37,14.4 15.37,6.02 v15.32,5.97
U0RXD
  Top 0.203: U3.50 25.41,24.2 27.43,22.17 30.28,22.17 RX.T
U0TXD
  Top 0.203: R12.1 30.8,20.31 TX.T
USB_D+
  Top 0.203: USB1.B6 8.27,17.44 8.59,17.75 | 8.59,17.75 8.76,17.75 | 8.76,17.75 R21.2 | USB1.A6 8.44,18.44 8.59,18.29 8.59,18.01 8.59,17.93 | 8.59,17.93 8.59,17.75 | 8.59,17.93 8.76,17.75
USB_D-
  Top 0.203: R20.2 9.14,18.94 USB1.B7 6.52,18.94 6.25,18.67 6.25,18.11 6.43,17.93 USB1.A7
VBAT
  Top 0.406: IC2.3 9.15,10.58 8.84,10.26 8.84,8.17 C20.2 9.54,6.03 BAT.1
VDD_CAM  (via drill 0.3)
  Top 0.203: J5.14 | 8.87,30.61 8.87,30.48 9.32,30.02 9.32,29.62 9.5,29.44 10.79,29.44 10.79,31.37 10.64,31.52 10.39,31.52 10.21,31.34 10.21,31.06 9.96,30.81 10.11,30.81 10.29,30.99 10.29,29.62 9.7,29.62 9.7,30.33 10.13,30.33 10.13,29.74 9.83,29.74 9.83,30.2 9.98,30.2 9.98,29.79 9.96,29.77 9.96,29.57 9.5,29.11 9.5,29.14 U16.3
  Top 0.305: J5.14 19.39,36.1 v19.28,36.22
  Top 0.61: 9.47,30.63 7.77,30.63 7.41,30.27 U16.1 U10.3 5.92,29.32 5.92,28.35 | 9.47,30.63 10.5,30.63 C30.2 | U16.3 9.31,30.46 9.47,30.63 | C27.2 C30.2 | C30.2 v10.58,31.28 v10.57,31.29 | U10.1 4.03,28.33 4.32,28.04 4.65,28.04 | 4.65,28.04 5.71,28.04 5.92,28.25 | 5.92,28.25 5.92,28.35 | 4.65,28.04 4.56,27.95 C29.2 C28.2 4.84,26.52 Q3.3 | 5.92,28.25 5.92,26.52 5.49,26.95 5.49,27.61 5.03,27.61 5.03,26.67 | 5.16,28.02 5.59,28.02 5.92,28.35
  Bottom 0.61: v19.28,36.22 12.14,36.22 10.57,34.65 v10.57,31.29
VDD_SPI
  Top 0.203: 13.36,15.32 C37.2 | C12.2 16.03,19.32 16.03,19.38 | U3.29 16.03,19.38 | 13.36,16.43 13.36,16.92 15.85,19.41 15.85,20.8 16,20.8 16,19.07 | 16,19.07 13.59,16.66 | 16,19.07 16.03,19.1 16.03,19.38
  Top 0.61: C37.2 C12.2 | 13.36,15.32 13.36,14.81 12.8,14.25 12.8,13.07 U4.8

### Text on the board
bPlace: MaTouch ESP32-S3 | AMOLED AI CAMERA V1.1 | www.makerfabs.com